# EAGLE schematic PCB-schematic-v1.2 (EAGLE 9.2.0)
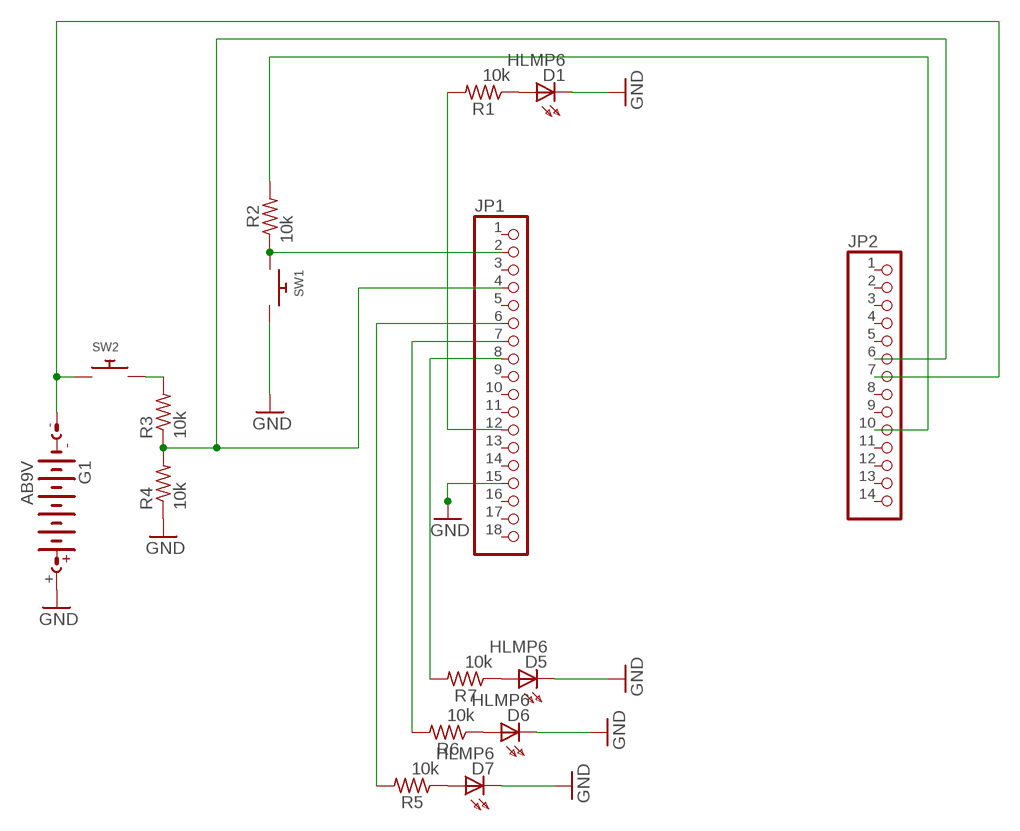
[diagram p0: schematic, sheet 1]

## Parts
D1  HLMP6  [HLMP6]
D5  HLMP6  [HLMP6]
D6  HLMP6  [HLMP6]
D7  HLMP6  [HLMP6]
G1  AB9V  [AB9V]
JP1  PINHD-1X18  [1X18]
JP2  PINHD-1X14  [1X14]
R1  10k  R-US_R0805  [R0805]
R2  10k  R-US_R0805  [R0805]
R3  10k  R-US_R0805  [R0805]
R4  10k  R-US_R0805  [R0805]
R5  10k  R-US_R0805  [R0805]
R6  10k  R-US_R0805  [R0805]
R7  10k  R-US_R0805  [R0805]
SW1  SWITCH_PUSHBUTTONSOFTTOUCHSMD_SJ  [PUSHBUTTON_SMD_SJ]
SW2  SWITCH_PUSHBUTTONSOFTTOUCHSMD_SJ  [PUSHBUTTON_SMD_SJ]

## Nets
GND: D1.K D5.K D6.K D7.K G1.+ JP1.15 R4.1 SW1.P$2
N$1: G1.- JP2.7 SW2.P$1
N$2: JP1.12 R1.2
N$3: D1.A R1.1
N$4: D5.A R7.1
N$5: JP1.2 R2.1 SW1.P$1
N$6: R3.2 SW2.P$2
N$7: D6.A R6.1
N$8: JP1.6 R5.2
N$9: D7.A R5.1
N$10: JP1.7 R6.2
N$11: JP1.8 R7.2
N$13: JP1.4 JP2.6 R3.1 R4.2
N$14: JP2.10 R2.2
Unconnected: JP1.1 JP1.3 JP1.5 JP1.9 JP1.10 JP1.11 JP1.13 JP1.14 JP1.16 JP1.17 JP1.18 JP2.1 JP2.2 JP2.3 JP2.4 JP2.5 JP2.8 JP2.9 JP2.11 JP2.12 JP2.13 JP2.14

## Library data of the parts
D1 D5-D7 = display-hp:HLMP6: LED 2mm horizontal; MF: AGILENT TECHNOLOGIES; MPN: HLMP-6500; OC_FARNELL: 1652490; OC_NEWARK: 40K0088
G1 = battery:AB9V: 9-V BATTERY CLIP
JP1 = adafruit:PINHD-1X18: PIN HEADER
JP2 = adafruit:PINHD-1X14: PIN HEADER
R1-R7 = rcl:R-US_: RESISTOR, American symbol; SPICEPREFIX: R
SW1 SW2 = adafruit:SWITCH_PUSHBUTTON: Buttons SOFTTOUCHSMD_SJ - Soft touch temporary push button (Super Junk Akihabara) Compatible with SKPMANE010 [Mouser: 688-SKPMAN] C&K_KSS = Digikey: KSS221GLFS